# EAGLE board CPU68K20 - v1.1.2 (EAGLE 5.08), part 1 of 15
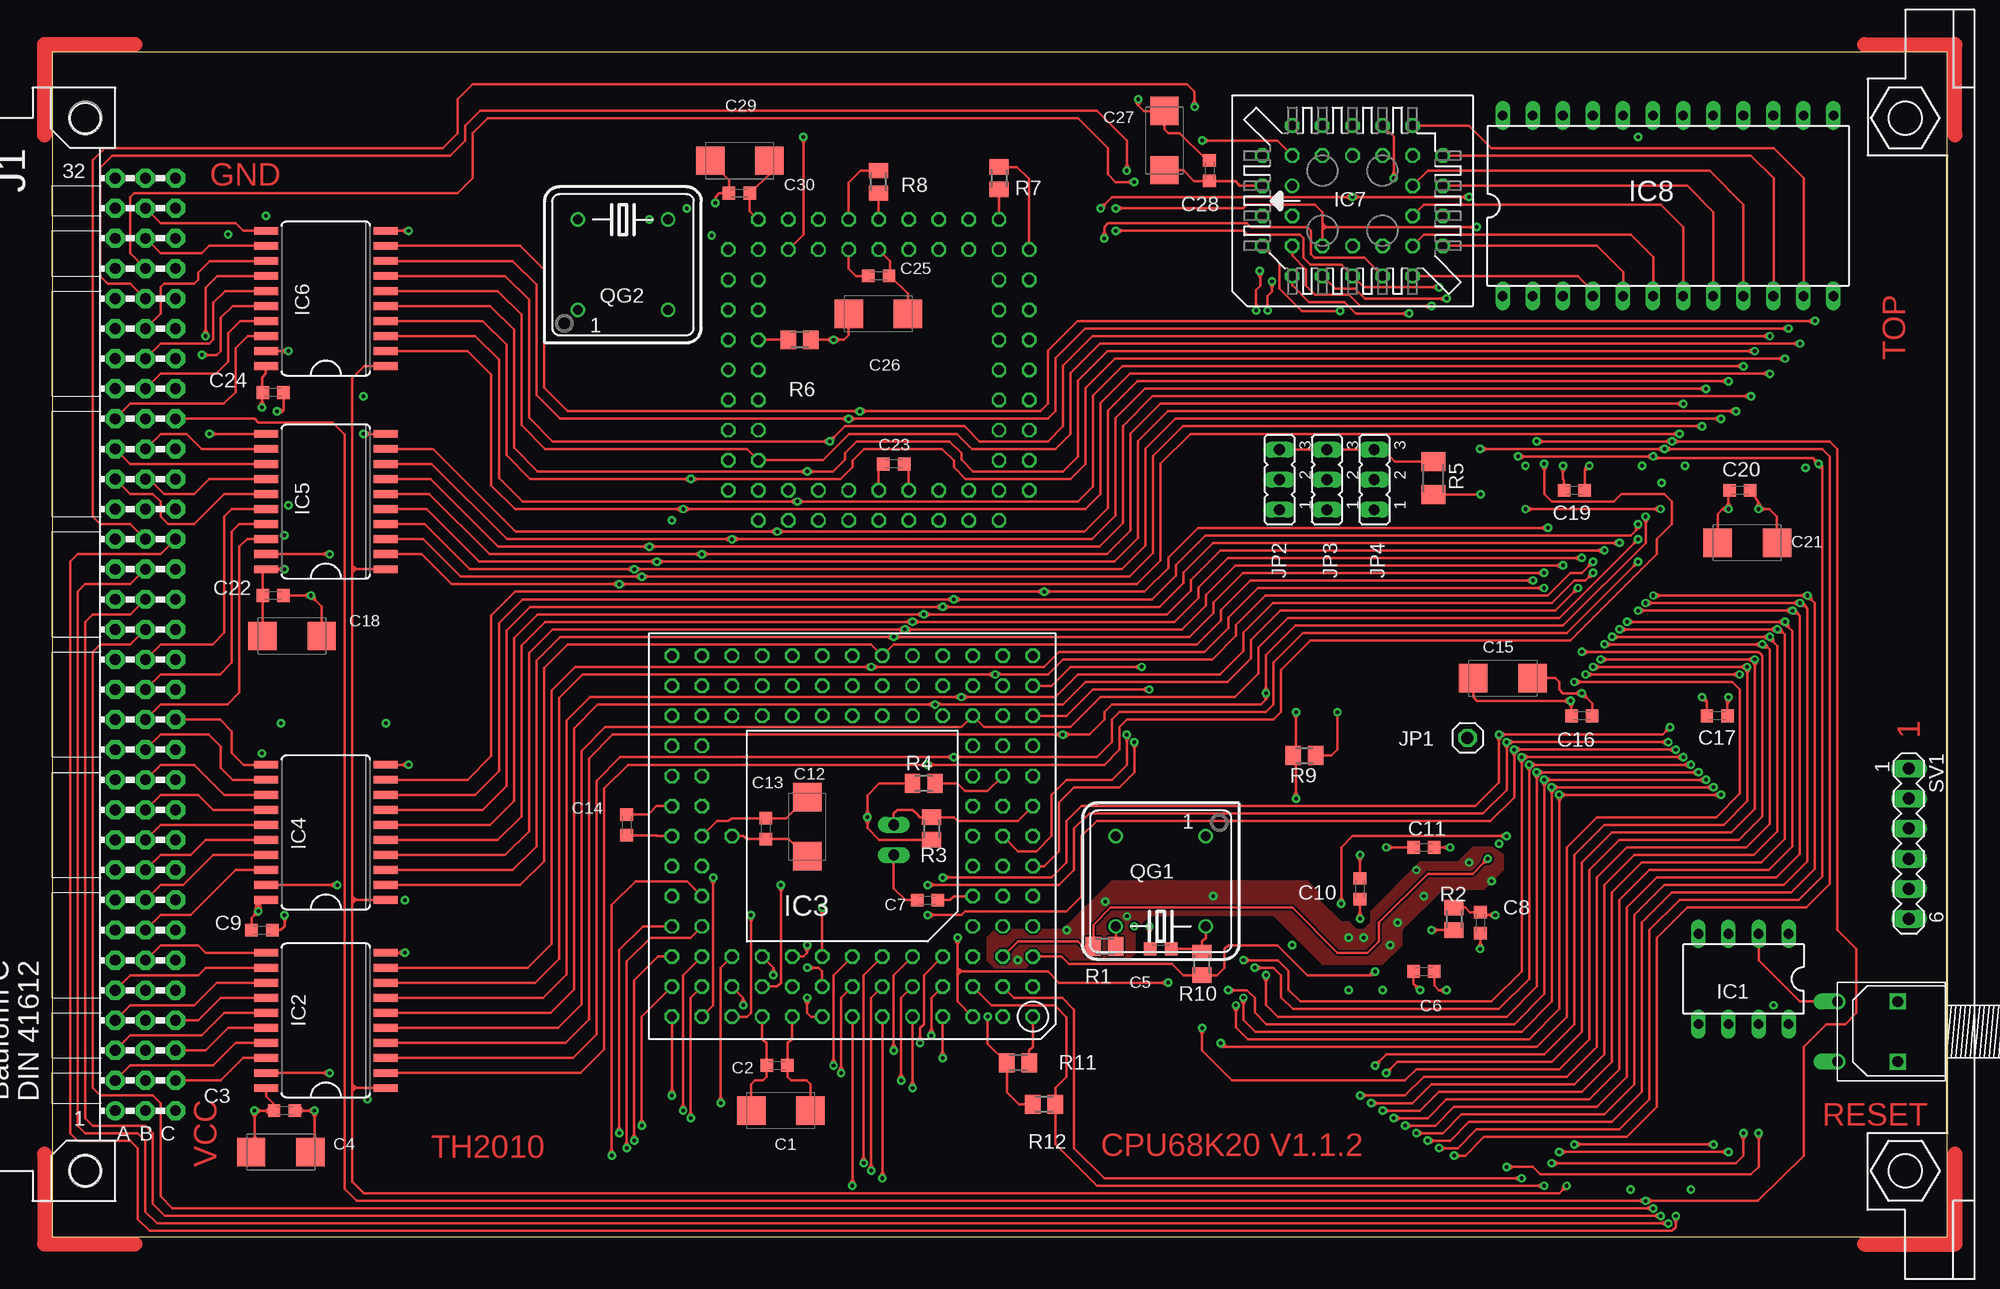
[diagram p2: board, top side]
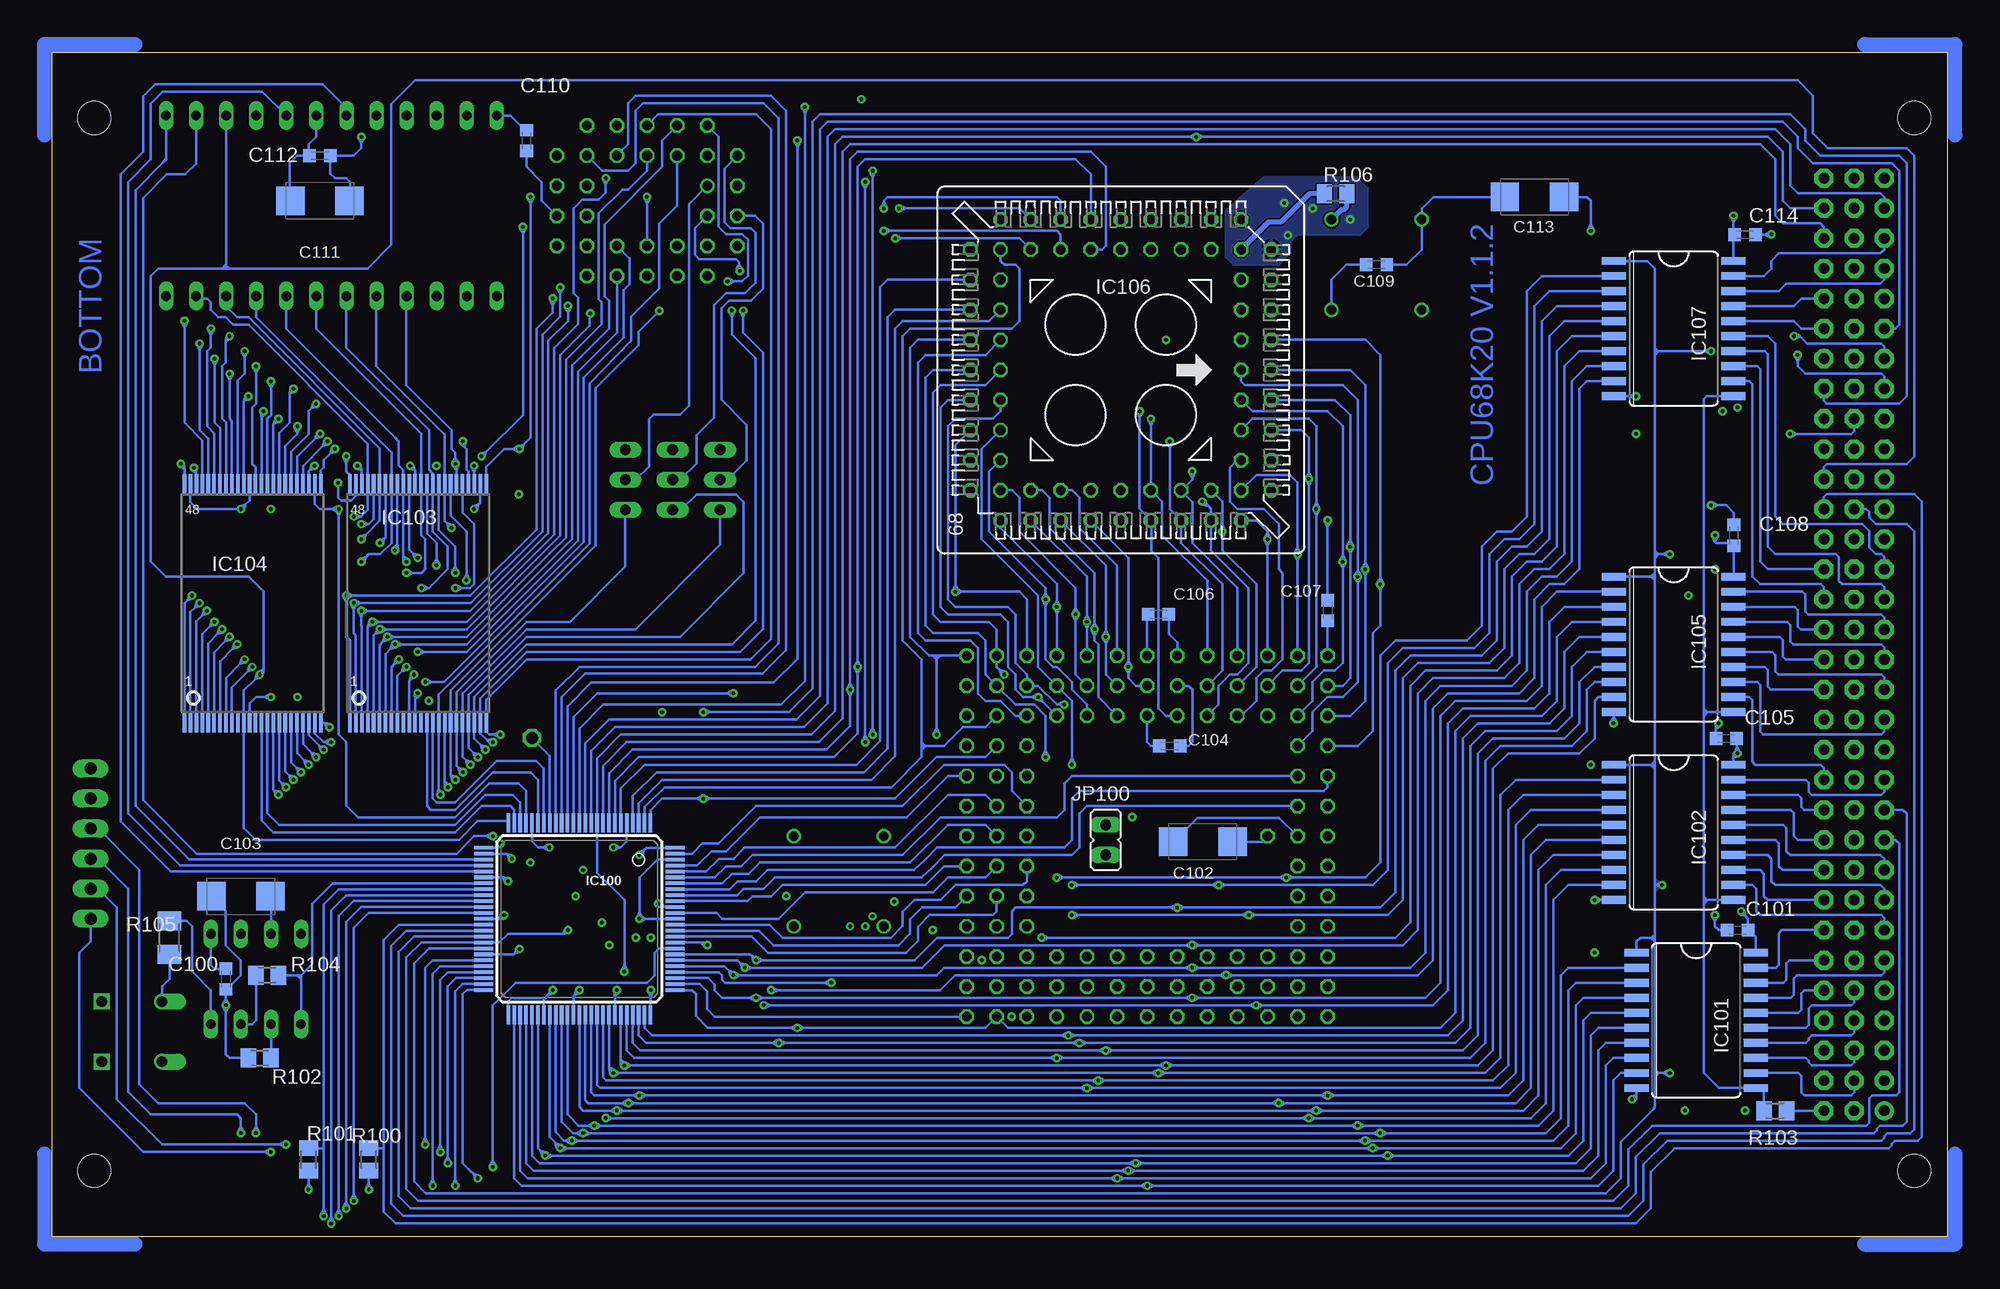
[diagram p3: board, bottom side, seen from below]

Size 160.02 x 100.03 mm. Coordinates in mm from the lower left corner, seen from the top.
Copper layers (1*2*3*16): Top 0.035mm / dielectric 0.36mm / $GND 0.018mm / dielectric 0.71mm / $VCC 0.035mm / dielectric 0.5mm / Bottom 0.035mm
Design rules "qp_designrules_6mil": minimum track width 6mil, minimum drill 0.3mm, track to track 6mil, track to pad 6mil, pad to pad 6mil, via to via 6mil, smd to smd 6mil, copper to edge 8mil, drill to drill 10mil, minimum pad ring 8mil, minimum via ring 8mil, stop-mask expansion 4mil, vias tented up to drill 16mil, thermal gap 10mil

## Footprints (pad centres in the part's own frame; a part is rotated, then mirrored left to right if it is on the bottom)
SMC_C = smd 2.4 x 2.4: + -2.5,0; - 2.5,0
C0603K = smd 1.05 x 1.08: 1 -0.875,0; 2 0.875,0
DIL08 = drill 0.813 long: 1 -3.81,-3.81; 2 -1.27,-3.81; 3 1.27,-3.81; 4 3.81,-3.81; 5 3.81,3.81; 6 1.27,3.81; 7 -1.27,3.81; 8 -3.81,3.81
SO20W = smd 0.66 x 2.032: 1 -5.715,-5.029; 2 -4.445,-5.029; 3 -3.175,-5.029; 4 -1.905,-5.029; 5 -0.635,-5.029; 6 0.635,-5.029; 7 1.905,-5.029; 8 3.175,-5.029; 9 4.445,-5.029; 10 5.715,-5.029; 11 5.715,5.029; 12 4.445,5.029; 13 3.175,5.029; 14 1.905,5.029; 15 0.635,5.029; 16 -0.635,5.029; 17 -1.905,5.029; 18 -3.175,5.029; 19 -4.445,5.029; 20 -5.715,5.029
MPGA114 = drill 0.813 octagon: A01 -15.24,15.24; A02 -12.7,15.24; A03 -10.16,15.24; A04 -7.62,15.24; A05 -5.08,15.24; A06 -2.54,15.24; A07 0,15.24; A08 2.54,15.24; A09 5.08,15.24; A10 7.62,15.24; A11 10.16,15.24; A12 12.7,15.24; A13 15.24,15.24; B01 -15.24,12.7; B02 -12.7,12.7; B03 -10.16,12.7; B04 -7.62,12.7; B05 -5.08,12.7; B06 -2.54,12.7; B07 0,12.7; B08 2.54,12.7; B09 5.08,12.7; B10 7.62,12.7; B11 10.16,12.7; B12 12.7,12.7; B13 15.24,12.7; C01 -15.24,10.16; C02 -12.7,10.16; C03 -10.16,10.16; C04 -7.62,10.16; C05 -5.08,10.16; C06 -2.54,10.16; C07 0,10.16; C08 2.54,10.16; C09 5.08,10.16; C10 7.62,10.16; C11 10.16,10.16; C12 12.7,10.16; C13 15.24,10.16; D01 -15.24,7.62; D02 -12.7,7.62; D03 -10.16,7.62; D12 12.7,7.62; D13 15.24,7.62; E01 -15.24,5.08; E02 -12.7,5.08; E03 -10.16,5.08; E12 12.7,5.08; E13 15.24,5.08; F01 -15.24,2.54; F02 -12.7,2.54; F03 -10.16,2.54; F12 12.7,2.54; F13 15.24,2.54; G01 -15.24,0; G02 -12.7,0; G03 -10.16,0; G11 10.16,0; G12 12.7,0; G13 15.24,0; H01 -15.24,-2.54; H02 -12.7,-2.54; H03 -10.16,-2.54; H12 12.7,-2.54; H13 15.24,-2.54; J01 -15.24,-5.08; J02 -12.7,-5.08; J03 -10.16,-5.08; J12 12.7,-5.08; J13 15.24,-5.08; K01 -15.24,-7.62; K02 -12.7,-7.62; K03 -10.16,-7.62; K12 12.7,-7.62; K13 15.24,-7.62; L01 -15.24,-10.16; L02 -12.7,-10.16; L03 -10.16,-10.16; L04 -7.62,-10.16; L05 -5.08,-10.16; L06 -2.54,-10.16; L07 0,-10.16; L08 2.54,-10.16; L09 5.08,-10.16; L10 7.62,-10.16; L11 10.16,-10.16; L12 12.7,-10.16; L13 15.24,-10.16; M01 -15.24,-12.7; M02 -12.7,-12.7; M03 -10.16,-12.7; M04 -7.62,-12.7; M05 -5.08,-12.7; M06 -2.54,-12.7; M07 0,-12.7; M08 2.54,-12.7; M09 5.08,-12.7; M10 7.62,-12.7; M11 10.16,-12.7; M12 12.7,-12.7; M13 15.24,-12.7; N01 -15.24,-15.24; N02 -12.7,-15.24; N03 -10.16,-15.24; N04 -7.62,-15.24; N05 -5.08,-15.24; N06 -2.54,-15.24; N07 0,-15.24; N08 2.54,-15.24; N09 5.08,-15.24; N10 7.62,-15.24; N11 10.16,-15.24; N12 12.7,-15.24; N13 15.24,-15.24
PLCC-S32 = drill 0.813 round: 1 1.27,5.08 | drill 0.813 octagon: 2 -1.27,7.62; 3 -1.27,5.08; 4 -3.81,7.62; 5 -6.35,5.08; 6 -3.81,5.08; 7 -6.35,2.54; 8 -3.81,2.54; 9 -6.35,0; 10 -3.81,0; 11 -6.35,-2.54; 12 -3.81,-2.54; 13 -6.35,-5.08; 14 -3.81,-7.62; 15 -3.81,-5.08; 16 -1.27,-7.62; 17 -1.27,-5.08; 18 1.27,-7.62; 19 1.27,-5.08; 20 3.81,-7.62; 21 6.35,-5.08; 22 3.81,-5.08; 23 6.35,-2.54; 24 3.81,-2.54; 25 6.35,0; 26 3.81,0; 27 6.35,2.54; 28 3.81,2.54; 29 6.35,5.08; 30 3.81,7.62; 31 3.81,5.08; 32 1.27,7.62
DIL24 = drill 0.813 long: 1 -13.97,-7.62; 2 -11.43,-7.62; 3 -8.89,-7.62; 4 -6.35,-7.62; 5 -3.81,-7.62; 6 -1.27,-7.62; 7 1.27,-7.62; 8 3.81,-7.62; 9 6.35,-7.62; 10 8.89,-7.62; 11 11.43,-7.62; 12 13.97,-7.62; 13 13.97,7.62; 14 11.43,7.62; 15 8.89,7.62; 16 6.35,7.62; 17 3.81,7.62; 18 1.27,7.62; 19 -1.27,7.62; 20 -3.81,7.62; 21 -6.35,7.62; 22 -8.89,7.62; 23 -11.43,7.62; 24 -13.97,7.62
VQ100 = smd 1.6 x 0.3: P1 -8.1,6; P2 -8.1,5.5; P3 -8.1,5; P4 -8.1,4.5; P5 -8.1,4; P6 -8.1,3.5; P7 -8.1,3; P8 -8.1,2.5; P9 -8.1,2; P10 -8.1,1.5; P11 -8.1,1; P12 -8.1,0.5; P13 -8.1,0; P14 -8.1,-0.5; P15 -8.1,-1; P16 -8.1,-1.5; P17 -8.1,-2; P18 -8.1,-2.5; P19 -8.1,-3; P20 -8.1,-3.5; P21 -8.1,-4; P22 -8.1,-4.5; P23 -8.1,-5; P24 -8.1,-5.5; P25 -8.1,-6; P51 8.1,-6; P52 8.1,-5.5; P53 8.1,-5; P54 8.1,-4.5; P55 8.1,-4; P56 8.1,-3.5; P57 8.1,-3; P58 8.1,-2.5; P59 8.1,-2; P60 8.1,-1.5; P61 8.1,-1; P62 8.1,-0.5; P63 8.1,0; P64 8.1,0.5; P65 8.1,1; P66 8.1,1.5; P67 8.1,2; P68 8.1,2.5; P69 8.1,3; P70 8.1,3.5; P71 8.1,4; P72 8.1,4.5; P73 8.1,5; P74 8.1,5.5; P75 8.1,6 | smd 0.3 x 1.6: P26 -6,-8.1; P27 -5.5,-8.1; P28 -5,-8.1; P29 -4.5,-8.1; P30 -4,-8.1; P31 -3.5,-8.1; P32 -3,-8.1; P33 -2.5,-8.1; P34 -2,-8.1; P35 -1.5,-8.1; P36 -1,-8.1; P37 -0.5,-8.1; P38 0,-8.1; P39 0.5,-8.1; P40 1,-8.1; P41 1.5,-8.1; P42 2,-8.1; P43 2.5,-8.1; P44 3,-8.1; P45 3.5,-8.1; P46 4,-8.1; P47 4.5,-8.1; P48 5,-8.1; P49 5.5,-8.1; P50 6,-8.1; P76 6,8.1; P77 5.5,8.1; P78 5,8.1; P79 4.5,8.1; P80 4,8.1; P81 3.5,8.1; P82 3,8.1; P83 2.5,8.1; P84 2,8.1; P85 1.5,8.1; P86 1,8.1; P87 0.5,8.1; P88 0,8.1; P89 -0.5,8.1; P90 -1,8.1; P91 -1.5,8.1; P92 -2,8.1; P93 -2.5,8.1; P94 -3,8.1; P95 -3.5,8.1; P96 -4,8.1; P97 -4.5,8.1; P98 -5,8.1; P99 -5.5,8.1; P100 -6,8.1
TSOP48W = smd 0.3 x 1.6: 1 0,-0.6; 2 0.5,-0.6; 3 1,-0.6; 4 1.5,-0.6; 5 2,-0.6; 6 2.5,-0.6; 7 3,-0.6; 8 3.5,-0.6; 9 4,-0.6; 10 4.5,-0.6; 11 5,-0.6; 12 5.5,-0.6; 13 6,-0.6; 14 6.5,-0.6; 15 7,-0.6; 16 7.5,-0.6; 17 8,-0.6; 18 8.5,-0.6; 19 9,-0.6; 20 9.5,-0.6; 21 10,-0.6; 22 10.5,-0.6; 23 11,-0.6; 24 11.5,-0.6; 25 11.5,19.6; 26 11,19.6; 27 10.5,19.6; 28 10,19.6; 29 9.5,19.6; 30 9,19.6; 31 8.5,19.6; 32 8,19.6; 33 7.5,19.6; 34 7,19.6; 35 6.5,19.6; 36 6,19.6; 37 5.5,19.6; 38 5,19.6; 39 4.5,19.6; 40 4,19.6; 41 3.5,19.6; 42 3,19.6; 43 2.5,19.6; 44 2,19.6; 45 1.5,19.6; 46 1,19.6; 47 0.5,19.6; 48 0,19.6
PLCC68-S = drill 0.813 round: 1 0,12.7 | drill 0.813 octagon: 2 0,10.16; 3 -2.54,12.7; 4 -2.54,10.16; 5 -5.08,12.7; 6 -5.08,10.16; 7 -7.62,12.7; 8 -7.62,10.16; 9 -10.16,12.7; 10 -12.7,10.16; 11 -10.16,10.16; 12 -12.7,7.62; 13 -10.16,7.62; 14 -12.7,5.08; 15 -10.16,5.08; 16 -12.7,2.54; 17 -10.16,2.54; 18 -12.7,0; 19 -10.16,0; 20 -12.7,-2.54; 21 -10.16,-2.54; 22 -12.7,-5.08; 23 -10.16,-5.08; 24 -12.7,-7.62; 25 -10.16,-7.62; 26 -12.7,-10.16; 27 -10.16,-12.7; 28 -10.16,-10.16; 29 -7.62,-12.7; 30 -7.62,-10.16; 31 -5.08,-12.7; 32 -5.08,-10.16; 33 -2.54,-12.7; 34 -2.54,-10.16; 35 0,-12.7; 36 0,-10.16; 37 2.54,-12.7; 38 2.54,-10.16; 39 5.08,-12.7; 40 5.08,-10.16; 41 7.62,-12.7; 42 7.62,-10.16; 43 10.16,-12.7; 44 12.7,-10.16; 45 10.16,-10.16; 46 12.7,-7.62; 47 10.16,-7.62; 48 12.7,-5.08; 49 10.16,-5.08; 50 12.7,-2.54; 51 10.16,-2.54; 52 12.7,0; 53 10.16,0; 54 12.7,2.54; 55 10.16,2.54; 56 12.7,5.08; 57 10.16,5.08; 58 12.7,7.62; 59 10.16,7.62; 60 12.7,10.16; 61 10.16,12.7; 62 10.16,10.16; 63 7.62,12.7; 64 7.62,10.16; 65 5.08,12.7; 66 5.08,10.16; 67 2.54,12.7; 68 2.54,10.16
VG96P = drill 0.914 pad 1.6 round: A1 154.94,39.37 | drill 0.914 pad 1.6 octagon: A2 154.94,36.83; A3 154.94,34.29; A4 154.94,31.75; A5 154.94,29.21; A6 154.94,26.67; A7 154.94,24.13; A8 154.94,21.59; A9 154.94,19.05; A10 154.94,16.51; A11 154.94,13.97; A12 154.94,11.43; A13 154.94,8.89; A14 154.94,6.35; A15 154.94,3.81; A16 154.94,1.27; A17 154.94,-1.27; A18 154.94,-3.81; A19 154.94,-6.35; A20 154.94,-8.89; A21 154.94,-11.43; A22 154.94,-13.97; A23 154.94,-16.51; A24 154.94,-19.05; A25 154.94,-21.59; A26 154.94,-24.13; A27 154.94,-26.67; A28 154.94,-29.21; A29 154.94,-31.75; A30 154.94,-34.29; A31 154.94,-36.83; A32 154.94,-39.37; B1 152.4,39.37; B2 152.4,36.83; B3 152.4,34.29; B4 152.4,31.75; B5 152.4,29.21; B6 152.4,26.67; B7 152.4,24.13; B8 152.4,21.59; B9 152.4,19.05; B10 152.4,16.51; B11 152.4,13.97; B12 152.4,11.43; B13 152.4,8.89; B14 152.4,6.35; B15 152.4,3.81; B16 152.4,1.27; B17 152.4,-1.27; B18 152.4,-3.81; B19 152.4,-6.35; B20 152.4,-8.89; B21 152.4,-11.43; B22 152.4,-13.97; B23 152.4,-16.51; B24 152.4,-19.05; B25 152.4,-21.59; B26 152.4,-24.13; B27 152.4,-26.67; B28 152.4,-29.21; B29 152.4,-31.75; B30 152.4,-34.29; B31 152.4,-36.83; B32 152.4,-39.37; C1 149.86,39.37; C2 149.86,36.83; C3 149.86,34.29; C4 149.86,31.75; C5 149.86,29.21; C6 149.86,26.67; C7 149.86,24.13; C8 149.86,21.59; C9 149.86,19.05; C10 149.86,16.51; C11 149.86,13.97; C12 149.86,11.43; C13 149.86,8.89; C14 149.86,6.35; C15 149.86,3.81; C16 149.86,1.27; C17 149.86,-1.27; C18 149.86,-3.81; C19 149.86,-6.35; C20 149.86,-8.89; C21 149.86,-11.43; C22 149.86,-13.97; C23 149.86,-16.51; C24 149.86,-19.05; C25 149.86,-21.59; C26 149.86,-24.13; C27 149.86,-26.67; C28 149.86,-29.21; C29 149.86,-31.75; C30 149.86,-34.29; C31 149.86,-36.83; C32 149.86,-39.37 | hole 2.794: 3.81,44.45; 3.81,-44.45; 157.48,44.45; 157.48,-44.45
1X01 = drill 1.016 octagon: 1 0,0
JP2 = drill 0.914 long: 1 -2.54,0; 2 0,0; 3 2.54,0
JP1 = drill 0.914 long: 1 0,-1.27; 2 0,1.27
DIL08S = drill 0.813 round: 1 -3.81,-3.81; 4 3.81,-3.81; 5 3.81,3.81; 8 -3.81,3.81
M0805 = smd 1.3 x 1.6: 1 -0.95,0; 2 0.95,0
M1206 = smd 1.6 x 2: 1 -1.4,0; 2 1.4,0
TS-21A = drill 0.9 offset: P1 0,0; P2 0,-5.08 | drill 0.9 square: P3 -5.08,0; P4 -5.08,-5.08
MA06-1 = drill 1.016 long: 1 -6.35,0; 2 -3.81,0; 3 -1.27,0; 4 1.27,0; 5 3.81,0; 6 6.35,0

## Placement (x,y rotation side)
C1  10µ/16  [SMC_C]  61.53,10.64 180 top
C2  100n  [C0603K]  61.21,14.45 180 top
C3  100n  [C0603K]  19.62,10.64 0 top
C4  10µ/16  [SMC_C]  19.3,7.15 0 top
C5  100n  [C0603K]  93.6,24.3 180 top
C6  100n  [C0603K]  115.82,22.39 180 top
C7  100n  [C0603K]  73.91,28.42 180 top
C8  100n  [C0603K]  120.59,26.52 270 top
C9  100n  [C0603K]  17.72,25.88 0 top
C10  100n  [C0603K]  110.43,29.38 90 top
C11  100n  [C0603K]  115.82,32.87 0 top
C12  10µ/16  [SMC_C]  63.75,34.62 90 top
C13  100n  [C0603K]  60.26,34.46 90 top
C14  100n  [C0603K]  48.51,34.77 90 top
C15  10µ/16  [SMC_C]  122.49,47.16 180 top
C16  100n  [C0603K]  129.16,43.98 180 top
C17  100n  [C0603K]  140.59,43.98 180 top
C18  10µ/16  [SMC_C]  20.25,50.72 0 top
C19  100n  [C0603K]  128.52,63.03 180 top
C20  100n  [C0603K]  142.49,63.03 180 top
C21  10µ/16  [SMC_C]  143.13,58.59 180 top
C22  100n  [C0603K]  18.67,54.14 0 top
C23  100n  [C0603K]  71.06,65.25 0 top
C24  100n  [C0603K]  18.67,71.29 0 top
C25  100n  [C0603K]  69.79,81.13 0 top
C26  10µ/16  [SMC_C]  69.75,77.92 0 top
C27  10µ/16  [SMC_C]  93.92,92.56 90 top
C28  100n  [C0603K]  97.73,90.02 90 top
C29  10µ/16  [SMC_C]  58.05,90.86 180 top
C30  100n  [C0603K]  58.02,88.12 180 top
C100  100n  [C0603K]  145.35,21.76 270 bottom
C101  100n  [C0603K]  17.72,25.88 180 bottom
C102  10µ/16  [SMC_C]  62.85,33.34 180 bottom
C103  10µ/16  [SMC_C]  144.08,28.74 180 bottom
C104  100n  [C0603K]  65.66,41.44 180 bottom
C105  100n  [C0603K]  18.67,42.08 180 bottom
C106  100n  [C0603K]  66.61,52.55 180 bottom
C107  100n  [C0603K]  52.32,52.87 90 bottom
C108  100n  [C0603K]  18.03,59.22 90 bottom
C109  100n  [C0603K]  48.2,82.08 180 bottom
C110  100n  [C0603K]  119.95,92.56 270 bottom
C111  10µ/16  [SMC_C]  137.41,87.48 0 bottom
C112  100n  [C0603K]  137.41,91.29 0 bottom
C113  10µ/16  [SMC_C]  34.86,87.8 0 bottom
C114  100n  [C0603K]  17.08,84.62 0 bottom
IC1  TLC7725D  [DIL08]  142.81,21.76 180 top
IC2  74HCT245DW  [SO20W]  23.11,18.26 90 top
IC3  [MPGA114]  67.56,33.82 180 top
IC4  74HCT245DW  [SO20W]  23.11,34.14 90 top
IC5  74HCT245DW  [SO20W]  23.11,62.08 90 top
IC6  74HCT245DW  [SO20W]  23.11,79.22 90 top
IC7  AM29F040JPLCC-S32  [PLCC-S32]  109.79,87.48 90 top
IC8  DS12C887DIL24  [DIL24]  136.44,87.05 0 top
IC100  XC95108VQ100VQ100  [VQ100]  115.51,26.84 270 bottom
IC101  74HCT573D  [SO20W]  21.21,18.26 270 bottom
IC102  74HCT573D  [SO20W]  23.11,34.14 270 bottom
IC103  CY62167ETSOP-W  [TSOP48W]  134.87,43.98 0 bottom
IC104  CY62167ETSOP-W  [TSOP48W]  148.84,43.98 0 bottom
IC105  74HCT573D  [SO20W]  23.11,50.01 270 bottom
IC106  [PLCC68-S]  69.79,73.19 270 bottom
IC107  74HCT573D  [SO20W]  23.11,76.68 270 bottom
J1  [VG96P]  160.27,50.01 180 top
JP1  [1X01]  119.51,42.12 0 top
JP2  [JP2]  103.63,63.92 90 top
JP3  [JP2]  107.63,63.92 90 top
JP4  [JP2]  111.63,63.92 90 top
JP100  CDIS  [JP1]  71.06,33.5 180 bottom
QG1  [DIL08S]  93.6,30.01 180 top
QG2  [DIL08S]  48.2,82.08 0 top
R1  10k  [M0805]  88.86,24.5 0 top
R2  10k  [M0805]  118.36,26.84 90 top
R3  10k  [M0805]  74.23,34.46 90 top
R4  10k  [M0805]  73.6,38.27 0 top
R5  10k  [M1206]  116.63,64.05 270 top
R6  10k  [M0805]  63.12,75.73 0 top
R7  10k  [M0805]  79.95,89.38 90 top
R8  10k  [M0805]  69.79,89.07 270 top
R9  10k  [M0805]  105.74,40.63 180 top
R10  10k  [M0805]  97.09,23.03 270 top
R11  10k  [M0805]  81.56,14.68 0 top
R12  10k  [M0805]  83.75,11.17 0 top
R100  10k  [M0805]  133.29,6.52 270 bottom
R101  10k  [M0805]  138.37,6.52 270 bottom
R102  10k  [M0805]  142.49,15.09 180 bottom
R103  10k  [M0805]  14.54,10.64 180 bottom
R104  10k  [M0805]  141.86,22.07 0 bottom
R105  10k  [M1206]  150.11,25.25 270 bottom
R106  10k  [M0805]  51.65,88.07 0 bottom
S1  [TS-21A]  150.75,14.77 180 top
SV1  [MA06-1]  156.78,33.19 270 top

## Tracks (layer width: path | path; a pad name or v marks a point on that pad's centre or on a via)
/AS  (via drill 0.3)
  Top 0.2: IC3.L01 85.66,43.98 87.88,46.2 92.14,46.2 | 92.14,46.2 92.2,46.2 | v92.65,46.2 92.2,46.2 | 92.14,46.2 | 92.14,46.2 92.2,46.17 | 92.52,45.98 | 92.14,46.2 92.2,46.24 | 92.14,46.2 92.2,46.17 | 92.14,46.2 92.2,46.24 | 92.52,46.42 | v92.65,46.2 92.52,46.42 | 92.2,46.2 92.5,45.99 v92.65,46.2 | 92.2,46.2 92.5,46.41 v92.65,46.2 | 92.52,45.98 92.2,46.17 | 92.52,45.98 | 92.2,46.17 92.49,46.4 | 92.2,46.24 92.49,46 | 92.49,46 | v92.65,46.2 92.49,46 | 92.52,46.42 92.2,46.24 | 92.52,45.98 92.2,46.17 | 92.52,45.98 | v92.65,46.2 92.52,45.98 | 92.2,46.17 92.49,46.4 | v92.65,46.2 92.49,46.4 | 92.2,46.24 92.49,46 | v92.65,46.2 92.49,46 | 92.52,46.42 92.2,46.24 | 92.14,46.2 | 92.14,46.2 92.52,45.98 | 92.52,45.98 | 92.52,45.98 | v92.65,46.2 92.52,45.98 | 92.14,46.2 92.52,46.42 | 92.52,46.42 | 92.52,46.42 v92.65,46.2 | 92.14,46.2 92.52,45.98 | 92.52,45.98 v92.65,46.2 | 92.14,46.2 92.52,46.42 | 92.52,46.42 | 92.52,46.42 v92.65,46.2 | 92.14,46.2 92.52,45.98 | v92.65,46.2 92.52,45.98 | 92.52,46.42 92.14,46.2 | 92.52,46.42 v92.65,46.2
  Bottom 0.2: v92.65,46.2 92.65,46.65 | 92.65,46.65 92.65,46.71 | IC106.21 71.37,83.35 71.06,83.67 71.06,90.33 72.33,91.61 92.01,91.61 92.65,90.97 92.65,46.71 | v92.65,46.2 92.65,45.75 | 92.65,45.75 92.65,45.69 | 92.65,45.69 92.65,43.12 94.65,41.12 111.01,41.12 113.01,39.12 IC100.P8 | 92.65,46.71 | 92.65,45.69 | 92.61,46.65 92.65,46.71 | 92.43,46.33 | v92.65,46.2 92.43,46.33 | 92.68,46.65 92.65,46.71 | 92.65,46.71 92.61,46.65 | 92.87,46.33 | 92.65,46.71 92.68,46.65 | 92.65,45.69 92.68,45.75 | 92.87,46.08 | 92.61,45.75 92.65,45.69 | 92.65,45.69 92.68,45.75 | 92.43,46.08 92.65,45.69 | 92.43,46.08 | v92.65,46.2 92.43,46.08 | 92.65,46.65 92.44,46.34 v92.65,46.2 | 92.65,46.65 92.86,46.34 v92.65,46.2 | 92.65,45.75 92.86,46.06 v92.65,46.2 | 92.65,45.75 92.44,46.06 v92.65,46.2 | 92.43,46.33 | 92.84,46.36 92.61,46.65 | v92.65,46.2 92.84,46.36 | 92.43,46.33 92.61,46.65 | 92.84,46.36 92.61,46.65 | v92.65,46.2 92.84,46.36 | 92.45,46.36 92.68,46.65 | 92.87,46.33 | 92.87,46.33 92.68,46.65 | v92.65,46.2 92.87,46.33 | 92.43,46.33 92.61,46.65 92.84,46.36 | v92.65,46.2 92.84,46.36 | 92.45,46.36 92.68,46.65 | v92.65,46.2 92.45,46.36 | 92.87,46.33 92.68,46.65 | 92.87,46.08 92.68,45.75 | 92.87,46.08 | 92.45,46.04 92.68,45.75 | 92.84,46.04 92.61,45.75 92.43,46.08 | 92.84,46.04 v92.65,46.2 | 92.87,46.08 | 92.87,46.08 92.68,45.75 | v92.65,46.2 92.87,46.08 | 92.45,46.04 92.68,45.75 | v92.65,46.2 92.45,46.04 | 92.84,46.04 92.61,45.75 | v92.65,46.2 92.84,46.04 | 92.43,46.08 92.61,45.75 | 92.43,46.33 92.65,46.71 | 92.65,45.69 | 92.43,46.33 92.65,46.71 | v92.65,46.2 92.43,46.33 | 92.65,46.71 | 92.87,46.33 | v92.65,46.2 92.87,46.33 | 92.43,46.33 92.65,46.71 | 92.43,46.33 | 92.65,46.71 | 92.87,46.33 92.65,46.71
  Bottom 0.2: v92.65,46.2 92.87,46.33 | 92.43,46.33 92.65,46.71 | v92.65,46.2 92.43,46.33 | 92.87,46.33 92.65,46.71 | v92.65,46.2 92.87,46.33 | 92.87,46.08 92.65,45.69 | 92.87,46.08 | 92.87,46.08 | v92.65,46.2 92.87,46.08 | 92.43,46.08 92.65,45.69 | 92.43,46.08 | v92.65,46.2 92.43,46.08 | 92.87,46.08 92.65,45.69 | v92.65,46.2 92.87,46.08 | 92.43,46.08 92.65,45.69 | 92.43,46.08 | v92.65,46.2 92.43,46.08 | 92.87,46.08 92.65,45.69 | v92.65,46.2 92.87,46.08 | 92.43,46.08 92.65,45.69 | v92.65,46.2 92.43,46.08
/AVEC
  Bottom 0.2: IC3.H02 81.22,37.31 84.39,37.31 88.84,32.87 101.54,32.87 102.49,31.91 103.71,31.91 104.79,30.84 IC100.P96
/BERR
  Top 0.2: R4.2 76.45,38.27 77.09,37.63 78.99,37.63 IC3.J02
/BG  (via drill 0.3)
  Top 0.2: IC3.B02 81.22,20.17 85.3,20.17 86.3,19.17 86.3,7.47 88.84,4.93 123.57,4.93 | 123.57,4.93 | 123.57,4.93 | 123.57,4.93 123.63,4.89 | 123.95,4.71 | 123.57,4.93 123.63,4.96 | 123.57,4.93 123.63,4.89 | 123.57,4.93 123.95,5.15 | 123.95,5.15 | v124.08,4.93 123.95,5.15 | 123.57,4.93 123.63,4.93 | v124.08,4.93 123.63,4.93 | 123.95,4.71 123.63,4.89 | 123.95,4.71 | 123.63,4.89 123.92,5.13 | 123.63,4.96 123.92,4.73 | 123.92,4.73 v124.08,4.93 | 123.95,5.15 123.63,4.96 | 123.95,4.71 123.63,4.89 | 123.95,4.71 | v124.08,4.93 123.95,4.71 | 123.63,4.89 123.92,5.13 | v124.08,4.93 123.92,5.13 | 123.63,4.96 123.92,4.73 | v124.08,4.93 123.92,4.73 | 123.95,5.15 123.63,4.96 | 123.63,4.93 123.94,4.72 v124.08,4.93 | 123.63,4.93 123.94,5.14 v124.08,4.93 | 123.57,4.93 123.95,4.71 | 123.95,4.71 | v124.08,4.93 123.95,4.71 | 123.57,4.93 123.95,5.15 | 123.95,5.15 | 123.95,5.15 v124.08,4.93 | 123.95,5.15 | 123.95,5.15 v124.08,4.93 | 123.95,4.71 123.57,4.93 | 123.95,4.71 | v124.08,4.93 123.95,4.71 | 123.95,5.15 123.57,4.93 | 123.57,4.93 123.95,4.71 | 123.95,4.71 v124.08,4.93 | 123.57,4.93 123.95,5.15 | 123.95,5.15 v124.08,4.93
  Bottom 0.2: IC100.P50 125,20.84 125.35,20.48 125.35,6.2 124.71,5.56 | v124.08,4.93 124.4,5.25 | 124.4,5.25 124.44,5.29 | 124.44,5.29 124.71,5.56 | 124.71,5.56 124.84,5.69 | 124.4,5.25 124.03,5.18 v124.08,4.93 | 124.4,5.25 124.33,4.88 v124.08,4.93 | 124.44,5.29 124.01,5.17 v124.08,4.93 | 124.44,5.29 124.32,4.86 v124.08,4.93
/BGACK
  Top 0.2: IC3.A01 82.8,16.04 82.49,15.72 82.49,14.7 R11.2
  Bottom 0.2: IC100.P77 105.35,21.34 104.71,20.7 104.71,19.22 104.08,18.58 IC3.A01
/BR  (via drill 0.3)
  Top 0.2: IC3.B03 79.31,19.53 84.66,19.53 85.66,18.53 85.66,13.5 84.71,12.55 R12.2 84.7,7.79 88.2,4.29 125.47,4.29 | 125.47,4.29 125.53,4.29 | v125.98,4.29 125.53,4.29 | 125.47,4.29 | 125.47,4.29 125.53,4.26 | 125.86,4.07 | 125.47,4.29 125.53,4.33 | 125.47,4.29 125.53,4.26 | 125.47,4.29 125.86,4.51 | 125.86,4.51 | v125.98,4.29 125.86,4.51 | 125.53,4.29 125.84,4.08 v125.98,4.29 | 125.53,4.29 125.84,4.5 v125.98,4.29 | 125.86,4.07 125.53,4.26 | 125.86,4.07 | 125.53,4.26 125.83,4.49 | 125.53,4.33 125.83,4.09 | 125.83,4.09 | v125.98,4.29 125.83,4.09 | 125.86,4.51 125.53,4.33 | 125.86,4.07 125.53,4.26 | 125.86,4.07 | v125.98,4.29 125.86,4.07 | 125.53,4.26 125.83,4.49 | v125.98,4.29 125.83,4.49 | 125.53,4.33 125.83,4.09 | v125.98,4.29 125.83,4.09 | 125.86,4.51 125.53,4.33 | 125.47,4.29 | 125.47,4.29 125.86,4.07 | 125.86,4.07 | 125.86,4.07 | v125.98,4.29 125.86,4.07 | 125.47,4.29 125.86,4.51 | 125.86,4.51 | 125.86,4.51 v125.98,4.29 | 125.47,4.29 125.86,4.07 | 125.86,4.07 v125.98,4.29 | 125.47,4.29 125.86,4.51 | 125.86,4.51 | 125.86,4.51 v125.98,4.29 | 125.47,4.29 125.86,4.07 | v125.98,4.29 125.86,4.07 | 125.86,4.51 125.47,4.29 | 125.86,4.51 v125.98,4.29
  Bottom 0.2: v125.98,4.29 125.98,4.74 | 125.98,4.74 125.98,4.8 | 125.98,4.8 125.98,20.7 125.35,21.34 IC100.P49 | 125.98,4.8 | 125.98,4.8 125.95,4.74 | 125.76,4.42 | 126.02,4.74 125.98,4.8 | 125.95,4.74 125.98,4.8 | 126.02,4.74 125.98,4.8 | 126.2,4.42 | v125.98,4.29 126.2,4.42 | 125.98,4.74 125.78,4.44 v125.98,4.29 | 125.98,4.74 126.19,4.44 v125.98,4.29 | 125.76,4.42 125.95,4.74 | 125.76,4.42 | 126.18,4.45 125.95,4.74 | 125.79,4.45 126.02,4.74 | 125.79,4.45 | v125.98,4.29 125.79,4.45 | 126.2,4.42 126.02,4.74 | 125.76,4.42 | 125.76,4.42 125.95,4.74 | v125.98,4.29 125.76,4.42 | 126.18,4.45 125.95,4.74 | v125.98,4.29 126.18,4.45 | 125.79,4.45 126.02,4.74 | v125.98,4.29 125.79,4.45 | 126.2,4.42 126.02,4.74 | 125.98,4.8 | 125.76,4.42 125.98,4.8 | 125.76,4.42 | 125.76,4.42 | v125.98,4.29 125.76,4.42 | 126.2,4.42 125.98,4.8 | 126.2,4.42 | v125.98,4.29 126.2,4.42 | 125.76,4.42 125.98,4.8 | v125.98,4.29 125.76,4.42 | 126.2,4.42 125.98,4.8 | 126.2,4.42 | v125.98,4.29 126.2,4.42 | 125.76,4.42 125.98,4.8 | v125.98,4.29 125.76,4.42 | 126.2,4.42 125.98,4.8 | v125.98,4.29 126.2,4.42
/BUSACK
  Bottom 0.2: J1.A31 5.33,87.8 5.65,88.11 12.64,88.11 13.27,88.75 13.27,92.24 14.54,93.51 93.92,93.51 94.55,92.88 94.55,45.03 96.55,43.03 112.51,43.03 114.51,41.03 IC100.P11
/BUSRQ
  Bottom 0.2: J1.A11 3.75,36.04 3.43,35.73 3.43,9.69 3.75,9.37 5.72,9.37 5.97,9.12 5.97,8.99 6.22,8.74 24.29,8.74 26.29,6.74 26.29,3.66 27.56,2.39 129.75,2.39 130.75,3.39 130.75,24.06 129.48,25.34 IC100.P41
/CDIS
  Top 0.2: IC3.H01 81.53,35.09 76.45,35.09 76.14,35.41 R3.2 73.28,35.41 72.96,35.72 72.96,35.73 72.64,36.04 71.37,36.04 71.06,35.73 JP100.1
/CS1
  Bottom 0.2: IC100.P17 117.51,46.11 115.51,48.11 100.68,48.11 98.68,50.11 98.68,94.46 99.95,95.73 110.11,95.73 110.74,95.1 110.74,90.65 111.38,90.02 113.6,90.02 IC7.22
/CS2  (via drill 0.3)
  Top 0.2: v135.83,61.44 135.38,61.44 | 135.38,61.44 135.32,61.44 | 124.91,61.44 124.85,61.44 | v124.4,61.44 124.85,61.44 | 135.32,61.44 124.91,61.44 | 124.91,61.44 | 124.91,61.44 124.84,61.48 | 124.52,61.66 | v124.4,61.44 124.52,61.66 | 124.91,61.44 124.84,61.41 | 124.91,61.44 124.84,61.48 | 124.91,61.44 124.84,61.41 | 124.52,61.22 | 135.32,61.44 | 135.32,61.44 135.38,61.41 | 135.7,61.22 | 135.38,61.48 135.32,61.44 | 135.32,61.44 135.38,61.41 | 135.7,61.66 135.32,61.44 | 135.7,61.66 | v135.83,61.44 135.7,61.66 | 124.85,61.44 124.54,61.65 v124.4,61.44 | 124.85,61.44 124.54,61.23 v124.4,61.44 | 124.52,61.66 | 124.84,61.48 124.56,61.24 | v124.4,61.44 124.56,61.24 | 124.52,61.66 124.84,61.48 | 124.84,61.48 124.56,61.24 | v124.4,61.44 124.56,61.24 | 124.84,61.41 124.56,61.64 | 124.84,61.41 124.52,61.22 | 124.52,61.22 | v124.4,61.44 124.52,61.22 | 124.52,61.66 124.84,61.48 | 124.84,61.48 124.56,61.24 | v124.4,61.44 124.56,61.24 | 124.56,61.64 124.84,61.41 | v124.4,61.44 124.56,61.64 | 124.52,61.22 124.84,61.41 | 135.38,61.44 135.68,61.23 v135.83,61.44 | 135.38,61.44 135.68,61.65 v135.83,61.44 | 135.7,61.22 135.38,61.41 | 135.7,61.22 | 135.67,61.64 135.38,61.41 | 135.67,61.24 135.38,61.48 | 135.67,61.24 | v135.83,61.44 135.67,61.24 | 135.7,61.66 135.38,61.48 | 135.7,61.22 | 135.7,61.22 135.38,61.41 | v135.83,61.44 135.7,61.22 | 135.67,61.64 135.38,61.41 | v135.83,61.44 135.67,61.64 | 135.67,61.24 135.38,61.48 | v135.83,61.44 135.67,61.24 | 135.7,61.66 135.38,61.48 | 124.91,61.44 124.52,61.66 | 124.52,61.66 124.91,61.44 | 124.52,61.66 v124.4,61.44 | 124.91,61.44 | 124.52,61.22 | v124.4,61.44 124.52,61.22 | 124.91,61.44 124.52,61.66 | 124.52,61.66 | 124.91,61.44 | 124.91,61.44 124.52,61.22
  Top 0.2: 124.52,61.22 v124.4,61.44 | 124.91,61.44 124.52,61.66 | 124.52,61.66 v124.4,61.44 | 124.91,61.44 124.52,61.22 | 124.52,61.22 v124.4,61.44 | 135.32,61.44 | 135.7,61.22 135.32,61.44 | 135.7,61.22 | 135.7,61.22 | v135.83,61.44 135.7,61.22 | 135.7,61.66 135.32,61.44 | 135.7,61.66 | v135.83,61.44 135.7,61.66 | 135.7,61.22 135.32,61.44 | v135.83,61.44 135.7,61.22 | 135.7,61.66 135.32,61.44 | 135.7,61.66 | v135.83,61.44 135.7,61.66 | 135.7,61.22 135.32,61.44 | v135.83,61.44 135.7,61.22 | 135.7,61.66 135.32,61.44 | v135.83,61.44 135.7,61.66
  Bottom 0.2: v135.83,61.44 136.28,61.44 | 136.28,61.44 136.34,61.44 | IC104.26 137.84,61.87 137.41,61.44 136.34,61.44 | IC103.26 123.87,61.97 124.04,61.8 | v124.4,61.44 124.08,61.76 | 124.08,61.76 124.04,61.8 | 124.04,61.8 | IC100.P22 120.01,37.63 120.64,38.27 123.13,38.27 125.98,35.41 134.19,35.41 135.19,36.41 135.19,41.76 135.83,42.39 135.83,60.93 | 135.83,60.93 135.83,60.99 | v135.83,61.44 135.83,60.99 | 124.04,61.8 | 124.46,61.69 124.04,61.8 | 124.15,61.38 124.04,61.8 | 124.04,61.8 | 124.04,61.8 124.05,61.73 | 124.1,61.78 124.04,61.8 | 124.1,61.78 | 136.34,61.44 | 135.83,60.93 136.05,61.32 | 135.83,60.93 | 136.28,61.48 136.34,61.44 | 135.95,61.66 | v135.83,61.44 135.95,61.66 | 136.28,61.41 136.34,61.44 | 136.34,61.44 136.28,61.48 | 135.95,61.22 | 136.34,61.44 136.28,61.41 | 135.83,60.93 135.86,60.99 | 136.05,61.32 | v135.83,61.44 136.05,61.32 | 135.83,60.93 135.79,60.99 | 135.83,60.93 135.86,60.99 | 135.83,60.93 135.79,60.99 | 135.61,61.32 | 124.08,61.76 124.15,61.4 v124.4,61.44 | 124.08,61.76 124.44,61.69 v124.4,61.44 | 124.15,61.41 124.1,61.78 | v124.4,61.44 124.15,61.41 | 124.46,61.69 124.1,61.78 | 124.15,61.38 124.05,61.73 | 124.15,61.38 | 124.42,61.69 124.05,61.73 | 124.15,61.38 124.05,61.73 | 124.42,61.69 124.05,61.73 | v124.4,61.44 124.42,61.69 | 124.15,61.41 124.1,61.78 | v124.4,61.44 124.15,61.41 | 124.46,61.69 124.1,61.78 | 136.28,61.44 135.97,61.65 v135.83,61.44 | 136.28,61.44 135.97,61.23 v135.83,61.44 | 135.83,60.99 136.04,61.3 v135.83,61.44 | 135.83,60.99 135.62,61.3 v135.83,61.44 | 135.95,61.66 | 135.99,61.24 136.28,61.48 | v135.83,61.44 135.99,61.24 | 135.95,61.66 136.28,61.48 | 135.99,61.24 136.28,61.48 | v135.83,61.44 135.99,61.24 | 135.99,61.64 136.28,61.41
  Bottom 0.2: 135.95,61.22 | 135.95,61.22 136.28,61.41 | v135.83,61.44 135.95,61.22 | 135.95,61.66 136.28,61.48 | 135.99,61.24 136.28,61.48 | v135.83,61.44 135.99,61.24 | 135.99,61.64 136.28,61.41 | v135.83,61.44 135.99,61.64 | 135.95,61.22 136.28,61.41 | 136.05,61.32 135.86,60.99 | 136.05,61.32 | 135.86,60.99 135.63,61.28 | v135.83,61.44 135.63,61.28 | 135.79,60.99 136.02,61.28 | 135.79,60.99 135.61,61.32 | 135.61,61.32 | v135.83,61.44 135.61,61.32 | 136.05,61.32 135.86,60.99 135.63,61.28 | v135.83,61.44 135.63,61.28 | 136.02,61.28 135.79,60.99 | v135.83,61.44 136.02,61.28 | 135.61,61.32 135.79,60.99 | v124.4,61.44 124.18,61.57 | 124.15,61.38 124.04,61.8 | v124.4,61.44 124.15,61.38 | 124.46,61.69 124.04,61.8 | 124.46,61.69 | v124.4,61.44 124.46,61.69 | 124.15,61.38 124.04,61.8 | v124.4,61.44 124.15,61.38 | 124.46,61.69 124.04,61.8 | v124.4,61.44 124.46,61.69 | 135.95,61.66 136.34,61.44 | 135.83,60.93 136.05,61.32 | 135.95,61.66 136.34,61.44 | v135.83,61.44 135.95,61.66 | 136.34,61.44 | 135.95,61.22 | v135.83,61.44 135.95,61.22 | 135.95,61.66 136.34,61.44 | 135.95,61.66 | 136.34,61.44 | 135.95,61.22 136.34,61.44 | v135.83,61.44 135.95,61.22 | 135.95,61.66 136.34,61.44 | v135.83,61.44 135.95,61.66 | 135.95,61.22 136.34,61.44 | v135.83,61.44 135.95,61.22 | 136.05,61.32 135.83,60.93 | 136.05,61.32 v135.83,61.44 | 135.83,60.93 | 135.61,61.32 | v135.83,61.44 135.61,61.32 | 135.83,60.93 136.05,61.32 | 136.05,61.32 | 135.83,60.93 | 135.83,60.93 135.61,61.32 | 135.61,61.32 v135.83,61.44 | 135.83,60.93 136.05,61.32 | 136.05,61.32 v135.83,61.44 | 135.83,60.93 135.61,61.32 | 135.61,61.32 v135.83,61.44
/DS  (via drill 0.3)
  Top 0.2: IC3.M01 84.39,46.52 85.98,48.11 91.5,48.11 | 91.5,48.11 91.56,48.11 | v92.01,48.11 91.56,48.11 | 91.5,48.11 | 91.5,48.11 91.56,48.07 | 91.89,47.89 | 91.5,48.11 91.56,48.14 | 91.5,48.11 91.56,48.07 | 91.5,48.11 91.56,48.14 | 91.89,48.33 | v92.01,48.11 91.89,48.33 | 91.56,48.11 91.87,47.9 v92.01,48.11 | 91.56,48.11 91.87,48.32 v92.01,48.11 | 91.89,47.89 91.56,48.07 | 91.89,47.89 | 91.56,48.07 91.85,48.31 | 91.56,48.14 91.85,47.91 | 91.85,47.91 | v92.01,48.11 91.85,47.91 | 91.89,48.33 91.56,48.14 | 91.89,47.89 91.56,48.07 | 91.89,47.89 | v92.01,48.11 91.89,47.89 | 91.56,48.07 91.85,48.31 | v92.01,48.11 91.85,48.31 | 91.56,48.14 91.85,47.91 | v92.01,48.11 91.85,47.91 | 91.89,48.33 91.56,48.14 | 91.5,48.11 | 91.5,48.11 91.89,47.89 | 91.89,47.89 | 91.89,47.89 | v92.01,48.11 91.89,47.89 | 91.5,48.11 91.89,48.33 | 91.89,48.33 | 91.89,48.33 v92.01,48.11 | 91.5,48.11 91.89,47.89 | 91.89,47.89 v92.01,48.11 | 91.5,48.11 91.89,48.33 | 91.89,48.33 | 91.89,48.33 v92.01,48.11 | 91.5,48.11 91.89,47.89 | v92.01,48.11 91.89,47.89 | 91.89,48.33 91.5,48.11 | 91.89,48.33 v92.01,48.11
  Bottom 0.2: v92.01,48.11 92.01,48.56 | 92.01,48.56 92.01,48.62 | IC106.20 72.33,89.7 73.6,90.97 91.38,90.97 92.01,90.33 92.01,48.62 | v92.01,48.11 92.01,47.66 | 92.01,47.66 92.01,47.6 | 92.01,47.6 92.01,42.49 94.01,40.49 110.51,40.49 112.51,38.49 IC100.P7 | 92.01,48.62 | 92.01,47.6 | 91.98,48.56 92.01,48.62 | 91.79,48.23 | v92.01,48.11 91.79,48.23 | 92.05,48.56 92.01,48.62 | 92.01,48.62 91.98,48.56 | 92.23,48.23 | 92.01,48.62 92.05,48.56 | 92.01,47.6 92.05,47.66 | 92.23,47.98 | 91.98,47.66 92.01,47.6 | 92.01,47.6 92.05,47.66 | 91.79,47.98 92.01,47.6 | 91.79,47.98 | v92.01,48.11 91.79,47.98 | 92.01,48.56 91.8,48.25 v92.01,48.11 | 92.01,48.56 92.22,48.25 v92.01,48.11 | 92.01,47.66 92.22,47.96 v92.01,48.11 | 92.01,47.66 91.8,47.96 v92.01,48.11 | 91.79,48.23 | 92.21,48.27 91.98,48.56 | v92.01,48.11 92.21,48.27 | 91.79,48.23 91.98,48.56 | 92.21,48.27 91.98,48.56 | v92.01,48.11 92.21,48.27 | 91.81,48.27 92.05,48.56 | 92.23,48.23 | 92.23,48.23 92.05,48.56 | v92.01,48.11 92.23,48.23 | 91.79,48.23 91.98,48.56 | 92.21,48.27 91.98,48.56 | v92.01,48.11 92.21,48.27 | 91.81,48.27 92.05,48.56 | v92.01,48.11 91.81,48.27 | 92.23,48.23 92.05,48.56 | 92.23,47.98 92.05,47.66 | 92.23,47.98 | 91.81,47.95 92.05,47.66 | 92.21,47.95 91.98,47.66 | 92.21,47.95 v92.01,48.11 | 91.79,47.98 91.98,47.66 | 92.23,47.98 | 92.23,47.98 92.05,47.66 | v92.01,48.11 92.23,47.98 | 91.81,47.95 92.05,47.66 | v92.01,48.11 91.81,47.95 | 92.21,47.95 91.98,47.66 | v92.01,48.11 92.21,47.95 | 91.79,47.98 91.98,47.66 | 91.79,48.23 92.01,48.62 | 92.01,47.6 | 91.79,48.23 92.01,48.62 | v92.01,48.11 91.79,48.23 | 92.01,48.62 | 92.23,48.23 | v92.01,48.11 92.23,48.23 | 91.79,48.23 92.01,48.62 | 91.79,48.23 | 92.01,48.62 | 92.23,48.23 92.01,48.62
  Bottom 0.2: v92.01,48.11 92.23,48.23 | 91.79,48.23 92.01,48.62 | v92.01,48.11 91.79,48.23 | 92.23,48.23 92.01,48.62 | v92.01,48.11 92.23,48.23 | 92.23,47.98 92.01,47.6 | 92.23,47.98 | 92.23,47.98 | v92.01,48.11 92.23,47.98 | 91.79,47.98 92.01,47.6 | 91.79,47.98 | v92.01,48.11 91.79,47.98 | 92.23,47.98 92.01,47.6 | v92.01,48.11 92.23,47.98 | 91.79,47.98 92.01,47.6 | 91.79,47.98 | v92.01,48.11 91.79,47.98 | 92.23,47.98 92.01,47.6 | v92.01,48.11 92.23,47.98 | 91.79,47.98 92.01,47.6 | v92.01,48.11 91.79,47.98
/DSACK0
  Bottom 0.2: IC3.H03 78.99,37.63 78.99,39.22 79.63,39.85 84.71,39.85 88.2,36.36 100.58,36.36 103.76,33.19 105.13,33.19 105.98,32.34 IC100.P99
/DSACK1
  Bottom 0.2: IC3.J01 84.39,38.9 87.88,35.41 100.27,35.41 103.12,32.55 104.35,32.55 105.35,31.55 105.56,31.34 IC100.P97
/FDSACK0
  Bottom 0.2: IC106.31 88.84,78.27 89.47,77.64 89.47,41.22 91.47,39.22 109.01,39.22 111.01,37.22 IC100.P4
/FDSACK1
  Bottom 0.2: IC106.32 80.9,77.32 88.2,77.32 88.84,76.68 88.84,40.58 90.84,38.58 108.51,38.58 110.51,36.58 IC100.P3
/FOE
  Bottom 0.2: IC100.P16 117.01,45.56 115.01,47.56 100.04,47.56 98.04,49.56 98.04,95.1 99.31,96.37 110.74,96.37 111.38,95.73 111.38,92.24 IC7.24
/FPU_CS
  Bottom 0.2: IC106.29 89.47,80.81 90.11,80.17 90.11,41.85 92.11,39.85 110.01,39.85 112.01,37.85 IC100.P6
/FWE  (via drill 0.3)
  Top 0.2: v97.09,92.56 97.54,92.56 | 97.54,92.56 97.6,92.56 | IC7.31 103.44,92.56 97.6,92.56 | 97.6,92.56 | 97.54,92.59 97.6,92.56 | 97.22,92.78 | v97.09,92.56 97.22,92.78 | 97.54,92.52 97.6,92.56 | 97.6,92.56 97.54,92.59 | 97.22,92.34 | 97.6,92.56 97.54,92.52 | 97.54,92.56 97.23,92.77 v97.09,92.56 | 97.54,92.56 97.23,92.35 v97.09,92.56 | 97.22,92.78 | 97.25,92.36 97.54,92.59 | v97.09,92.56 97.25,92.36 | 97.22,92.78 97.54,92.59 | 97.25,92.36 97.54,92.59 | v97.09,92.56 97.25,92.36 | 97.25,92.75 97.54,92.52 | 97.22,92.34 | 97.22,92.34 97.54,92.52 | v97.09,92.56 97.22,92.34 | 97.22,92.78 97.54,92.59 | 97.25,92.36 97.54,92.59 | v97.09,92.56 97.25,92.36 | 97.25,92.75 97.54,92.52 | v97.09,92.56 97.25,92.75 | 97.22,92.34 97.54,92.52 | 97.22,92.78 97.6,92.56 | 97.22,92.78 97.6,92.56 | v97.09,92.56 97.22,92.78 | 97.6,92.56 | 97.22,92.34 | v97.09,92.56 97.22,92.34 | 97.22,92.78 97.6,92.56 | 97.22,92.78 | 97.6,92.56 | 97.22,92.34 97.6,92.56 | v97.09,92.56 97.22,92.34 | 97.22,92.78 97.6,92.56 | v97.09,92.56 97.22,92.78 | 97.22,92.34 97.6,92.56 | v97.09,92.56 97.22,92.34
  Bottom 0.2: 97.09,92.05 97.09,92.11 | v97.09,92.56 97.09,92.11 | IC100.P15 116.51,44.79 114.51,46.79 99.09,46.79 97.09,48.79 97.09,92.05 | 97.09,92.05 97.31,92.43 | 97.09,92.05 | 97.09,92.05 97.13,92.11 | 97.31,92.43 | v97.09,92.56 97.31,92.43 | 97.09,92.05 97.06,92.11 | 97.09,92.05 97.13,92.11 | 97.09,92.05 97.06,92.11 | 96.87,92.43 | 97.09,92.11 97.3,92.41 v97.09,92.56 | 97.09,92.11 96.88,92.41 v97.09,92.56 | 97.31,92.43 97.13,92.11 | 97.31,92.43 | 97.13,92.11 96.89,92.4 | v97.09,92.56 96.89,92.4 | 97.06,92.11 97.29,92.4 | 97.06,92.11 96.87,92.43 | 96.87,92.43 | v97.09,92.56 96.87,92.43 | 97.31,92.43 97.13,92.11 96.89,92.4 | v97.09,92.56 96.89,92.4 | 97.29,92.4 97.06,92.11 | v97.09,92.56 97.29,92.4 | 96.87,92.43 97.06,92.11 | 97.09,92.05 97.31,92.43 | 97.31,92.43 97.09,92.05 | 97.31,92.43 v97.09,92.56 | 97.09,92.05 | 96.87,92.43 | v97.09,92.56 96.87,92.43 | 97.09,92.05 97.31,92.43 | 97.31,92.43 | 97.09,92.05 | 97.09,92.05 96.87,92.43 | 96.87,92.43 v97.09,92.56 | 97.09,92.05 97.31,92.43 | 97.31,92.43 v97.09,92.56 | 97.09,92.05 96.87,92.43 | 96.87,92.43 v97.09,92.56
/HALT  (via drill 0.3)
  Top 0.2: v105.03,44.3 105.03,43.85 | 105.03,43.85 105.03,43.79 | 105.03,37.51 105.03,37.45 | v105.03,36.99 105.03,37.45 | 105.25,44.17 105.03,43.79 | 105.03,43.79 | 105.03,40.81 105.03,37.51 | 105.03,43.79 105.03,40.81 | 105.03,43.79 105.06,43.85 | 105.25,44.17 | v105.03,44.3 105.25,44.17 | 104.99,43.85 105.03,43.79 | 105.03,43.79 105.06,43.85 | 104.81,44.17 | 105.03,43.79 104.99,43.85 | 105.03,37.51 | 105.03,37.51 104.99,37.44 | 104.81,37.12 | 105.03,37.51 105.06,37.44 | 105.03,37.51 104.99,37.44 | 105.03,37.51 105.06,37.44 | 105.25,37.12 | v105.03,36.99 105.25,37.12 | 105.03,43.85 105.24,44.15 v105.03,44.3 | 105.03,43.85 104.82,44.15 v105.03,44.3 | 105.25,44.17 105.06,43.85 | 105.25,44.17 | 104.83,44.14 105.06,43.85 | v105.03,44.3 104.83,44.14 | 105.23,44.14 104.99,43.85 | 104.81,44.17 | 104.81,44.17 104.99,43.85 | v105.03,44.3 104.81,44.17 | 105.25,44.17 105.06,43.85 | 104.83,44.14 105.06,43.85 | v105.03,44.3 104.83,44.14 | 105.23,44.14 104.99,43.85 | v105.03,44.3 105.23,44.14 | 104.81,44.17 104.99,43.85 | 105.03,37.45 104.82,37.14 v105.03,36.99 | 105.03,37.45 105.24,37.14 v105.03,36.99 | 104.81,37.12 104.99,37.44 | 104.81,37.12 | 104.99,37.44 105.23,37.15 | 105.06,37.44 104.83,37.15 | 104.83,37.15 | v105.03,36.99 104.83,37.15 | 105.25,37.12 105.06,37.44 | 104.81,37.12 104.99,37.44 | 104.81,37.12 | v105.03,36.99 104.81,37.12 | 104.99,37.44 105.23,37.15 | v105.03,36.99 105.23,37.15 | 105.06,37.44 104.83,37.15 | v105.03,36.99 104.83,37.15 | 105.25,37.12 105.06,37.44 | 105.25,44.17 105.03,43.79 | 105.25,44.17 105.03,43.79 | v105.03,44.3 105.25,44.17 | 105.03,43.79 | 104.81,44.17 | v105.03,44.3 104.81,44.17 | 105.25,44.17 105.03,43.79 | 105.25,44.17 | 105.03,43.79 | 104.81,44.17 105.03,43.79
  Top 0.2: v105.03,44.3 104.81,44.17 | 105.25,44.17 105.03,43.79 | v105.03,44.3 105.25,44.17 | 104.81,44.17 105.03,43.79 | v105.03,44.3 104.81,44.17 | 105.03,37.51 | 105.03,37.51 104.81,37.12 | 104.81,37.12 | 104.81,37.12 | v105.03,36.99 104.81,37.12 | 105.03,37.51 105.25,37.12 | 105.25,37.12 | 105.25,37.12 v105.03,36.99 | 105.03,37.51 104.81,37.12 | 104.81,37.12 v105.03,36.99 | 105.03,37.51 105.25,37.12 | 105.25,37.12 | 105.25,37.12 v105.03,36.99 | 105.03,37.51 104.81,37.12 | v105.03,36.99 104.81,37.12 | 105.25,37.12 105.03,37.51 | 105.25,37.12 v105.03,36.99 | R9.2 104.95,40.73 105.03,40.81
  Bottom 0.2: J1.C25 10.41,70.59 10.16,70.33 4.06,70.33 3.43,70.97 3.43,90.65 4.06,91.29 10.73,91.29 12,92.56 12,93.51 13.27,94.78 95.19,94.78 95.82,94.14 95.82,46.3 97.82,44.3 104.52,44.3 | IC3.K02 81.22,40.49 85.34,40.49 88.84,36.99 104.52,36.99 | v105.03,36.99 105.48,36.99 | 105.48,36.99 105.54,36.99 | IC100.P1 109.51,36.01 108.52,36.99 105.54,36.99 | 104.52,44.3 104.58,44.3 | v105.03,44.3 104.58,44.3 | v105.03,36.99 104.58,36.99 | 104.58,36.99 104.52,36.99 | 104.52,44.3 | 104.52,44.3 104.58,44.26 | 104.9,44.08 | 104.52,44.3 104.58,44.33 | 104.52,44.3 104.58,44.26 | 104.52,44.3 104.9,44.52 | 104.9,44.52 | v105.03,44.3 104.9,44.52 | 105.54,36.99 | 104.52,36.99 | 105.48,37.03 105.54,36.99 | 105.16,37.21 | v105.03,36.99 105.16,37.21 | 105.48,36.96 105.54,36.99 | 105.54,36.99 105.48,37.03 | 105.16,36.78 | 105.54,36.99 105.48,36.96 | 104.52,36.99 104.58,36.96 | 104.9,36.78 | 104.58,37.03 104.52,36.99 | 104.52,36.99 104.58,36.96 | 104.9,37.21 104.52,36.99 | 104.9,37.21 | v105.03,36.99 104.9,37.21 | 104.58,44.3 104.89,44.09 v105.03,44.3 | 104.58,44.3 104.89,44.51 v105.03,44.3 | 104.9,44.08 104.58,44.26 | 104.9,44.08 | 104.58,44.26 104.87,44.49 | 104.58,44.33 104.87,44.1 | 104.87,44.1 | v105.03,44.3 104.87,44.1 | 104.9,44.52 104.58,44.33 | 104.9,44.08 104.58,44.26 | 104.9,44.08 | v105.03,44.3 104.9,44.08 | 104.58,44.26 104.87,44.49 | v105.03,44.3 104.87,44.49 | 104.58,44.33 104.87,44.1 | v105.03,44.3 104.87,44.1 | 104.9,44.52 104.58,44.33 | 105.48,36.99 105.17,37.2 v105.03,36.99 | 105.48,36.99 105.17,36.79 v105.03,36.99 | 104.58,36.99 104.89,36.79 v105.03,36.99 | 104.58,36.99 104.89,37.2 v105.03,36.99 | 105.16,37.21 | 105.19,36.8 105.48,37.03 | v105.03,36.99 105.19,36.8
  Bottom 0.2: 105.16,37.21 105.48,37.03 | 105.19,36.8 105.48,37.03 | v105.03,36.99 105.19,36.8 | 105.19,37.19 105.48,36.96 | 105.16,36.78 | 105.16,36.78 105.48,36.96 | v105.03,36.99 105.16,36.78 | 105.16,37.21 105.48,37.03 105.19,36.8 | v105.03,36.99 105.19,36.8 | 105.19,37.19 105.48,36.96 | v105.03,36.99 105.19,37.19 | 105.16,36.78 105.48,36.96 | 104.9,36.78 104.58,36.96 | 104.9,36.78 | 104.87,37.19 104.58,36.96 | 104.87,36.8 104.58,37.03 104.9,37.21 | 104.87,36.8 | v105.03,36.99 104.87,36.8 | 104.9,36.78 | 104.9,36.78 104.58,36.96 | v105.03,36.99 104.9,36.78 | 104.87,37.19 104.58,36.96 | v105.03,36.99 104.87,37.19 | 104.87,36.8 104.58,37.03 | v105.03,36.99 104.87,36.8 | 104.9,37.21 104.58,37.03 | 104.52,44.3 | 104.52,44.3 104.9,44.08 | 104.9,44.08 | 104.9,44.08 | v105.03,44.3 104.9,44.08 | 104.52,44.3 104.9,44.52 | 104.9,44.52 | 104.9,44.52 v105.03,44.3 | 104.52,44.3 104.9,44.08 | 104.9,44.08 v105.03,44.3 | 104.52,44.3 104.9,44.52 | 104.9,44.52 | 104.9,44.52 v105.03,44.3 | 104.52,44.3 104.9,44.08 | v105.03,44.3 104.9,44.08 | 104.9,44.52 104.52,44.3 | 104.9,44.52 v105.03,44.3 | 105.16,37.21 105.54,36.99 | 104.52,36.99 | 105.16,37.21 105.54,36.99 | v105.03,36.99 105.16,37.21 | 105.54,36.99 | 105.16,36.78 | v105.03,36.99 105.16,36.78 | 105.16,37.21 105.54,36.99 | 105.16,37.21 | 105.54,36.99 | 105.16,36.78 105.54,36.99 | v105.03,36.99 105.16,36.78 | 105.16,37.21 105.54,36.99 | v105.03,36.99 105.16,37.21 | 105.16,36.78 105.54,36.99 | v105.03,36.99 105.16,36.78 | 104.9,36.78 104.52,36.99 | 104.9,36.78 | 104.9,36.78 | v105.03,36.99 104.9,36.78 | 104.9,37.21 104.52,36.99 | 104.9,37.21 | v105.03,36.99 104.9,37.21 | 104.9,36.78 104.52,36.99 | v105.03,36.99 104.9,36.78 | 104.9,37.21 104.52,36.99 | 104.9,37.21
  Bottom 0.2: v105.03,36.99 104.9,37.21 | 104.9,36.78 104.52,36.99 | v105.03,36.99 104.9,36.78 | 104.9,37.21 104.52,36.99 | v105.03,36.99 104.9,37.21
/INT
  Bottom 0.2: J1.C21 10.41,62.46 10.16,62.71 2.79,62.71 2.16,62.08 2.16,8.42 2.48,8.1 4.45,8.1 4.7,7.85 4.7,7.72 4.95,7.47 23.02,7.47 25.02,5.47 25.02,2.39 26.29,1.12 131.02,1.12 132.02,2.12 132.02,7.47 | 132.02,7.47 132.02,25.06 130.75,26.34 IC100.P39 | R100.1 132.02,7.47
/IPL0
  Bottom 0.2: IC3.J12 73.91,38.9 74.55,38.27 74.55,36.04 75.18,35.41 85.03,35.41 88.2,32.23 100.9,32.23 101.85,31.28 103.13,31.28 104.08,30.34 IC100.P95
/IPL1
  Bottom 0.2: IC3.J13 52.32,37.95 52.64,37.63 73.28,37.63 73.91,36.99 73.91,33.5 74.55,32.87 85.3,32.87 86.3,31.87 87.25,30.96 99.63,30.96 100.58,30.01 102.13,30.01 102.81,29.34 IC100.P93
/IPL2
  Bottom 0.2: IC3.H12 72.64,36.36 73.28,35.73 73.28,32.87 73.91,32.23 84.66,32.23 85.66,31.23 86.61,30.33 99,30.33 99.95,29.38 101.63,29.38 102.17,28.84 IC100.P92
/NMI  (via drill 0.3)
  Top 0.2: J1.C20 9.14,57.63 2.16,57.63 1.52,57 1.52,8.74 2.16,8.1 6.6,8.1 7.24,7.47 7.24,1.48 8.24,0.48 136.78,0.48 137.1,0.8 137.1,1.24 | 137.1,1.24 137.1,1.3 | v137.1,1.75 137.1,1.3 | 137.1,1.24 137.32,1.63 | 137.1,1.24 | 137.1,1.24 137.13,1.3 | 137.32,1.63 | v137.1,1.75 137.32,1.63 | 137.1,1.24 137.06,1.3 | 137.1,1.24 137.13,1.3 | 137.1,1.24 137.06,1.3 | 136.88,1.63 | 137.1,1.3 137.31,1.61 v137.1,1.75 | 137.1,1.3 136.89,1.61 v137.1,1.75 | 137.32,1.63 137.13,1.3 | 137.32,1.63 | 137.13,1.3 136.9,1.59 v137.1,1.75 | 137.06,1.3 137.29,1.59 | 137.06,1.3 136.88,1.63 | 136.88,1.63 | v137.1,1.75 136.88,1.63 | 137.32,1.63 137.13,1.3 | 137.13,1.3 136.9,1.59 v137.1,1.75 | 137.29,1.59 137.06,1.3 | v137.1,1.75 137.29,1.59 | 136.88,1.63 137.06,1.3 | 137.1,1.24 137.32,1.63 | 137.32,1.63 137.1,1.24 | 137.32,1.63 v137.1,1.75 | 137.1,1.24 | 136.88,1.63 | v137.1,1.75 136.88,1.63 | 137.1,1.24 137.32,1.63 | 137.32,1.63 | 137.1,1.24 | 137.1,1.24 136.88,1.63 | 136.88,1.63 v137.1,1.75 | 137.1,1.24 137.32,1.63 | 137.32,1.63 v137.1,1.75 | 137.1,1.24 136.88,1.63 | 136.88,1.63 v137.1,1.75
  Bottom 0.2: v137.1,1.75 137.1,2.2 | 137.1,2.2 137.1,2.26 | 137.1,2.26 137.1,7.47 | 137.1,7.47 137.1,28.06 135.83,29.34 IC100.P33 | R101.1 137.1,7.47 | 137.1,2.26 | 137.1,2.26 137.06,2.2 | 136.88,1.88 | 137.13,2.2 137.1,2.26 | 137.06,2.2 137.1,2.26 | 137.13,2.2 137.1,2.26 | 137.32,1.88 | v137.1,1.75 137.32,1.88 | 137.1,2.2 136.89,1.9 v137.1,1.75 | 137.1,2.2 137.31,1.9 v137.1,1.75 | 136.88,1.88 137.06,2.2 | 136.88,1.88 | 137.29,1.91 137.06,2.2 | 136.9,1.91 137.13,2.2 | 136.9,1.91 | v137.1,1.75 136.9,1.91 | 137.32,1.88 137.13,2.2 | 136.88,1.88 | 136.88,1.88 137.06,2.2 | v137.1,1.75 136.88,1.88 | 137.29,1.91 137.06,2.2 | v137.1,1.75 137.29,1.91 | 136.9,1.91 137.13,2.2 | v137.1,1.75 136.9,1.91 | 137.32,1.88 137.13,2.2 | 137.1,2.26 | 136.88,1.88 137.1,2.26 | 136.88,1.88 | 136.88,1.88 | v137.1,1.75 136.88,1.88 | 137.32,1.88 137.1,2.26 | 137.32,1.88 | v137.1,1.75 137.32,1.88 | 136.88,1.88 137.1,2.26 | v137.1,1.75 136.88,1.88 | 137.32,1.88 137.1,2.26 | 137.32,1.88 | v137.1,1.75 137.32,1.88 | 136.88,1.88 137.1,2.26 | v137.1,1.75 136.88,1.88 | 137.32,1.88 137.1,2.26 | v137.1,1.75 137.32,1.88
/RES
  Bottom 0.2: IC100.P32 136.32,29.84 138.05,28.11 138.05,23.02 139,22.07 | 139,22.07 139,21.75 | 139,21.75 IC1.5 | 139,22.07 139.32,22.07 | 139.32,22.07 R104.2 | 139,21.75 139.32,22.07
/RESET  (via drill 0.3)
  Top 0.2: IC106.13 63.44,84.62 63.44,92.36 | v63.44,92.88 63.44,92.42 | 63.44,92.42 63.44,92.36 | IC3.C01 85.22,23.66 85.86,23.02 94.55,23.02 95.51,22.07 R10.2 98.36,22.07 99,22.71 99,24.29 99.31,24.61 103.44,24.61 105.98,22.07 111.3,22.07 | 111.38,22.07 v111.7,22.39 | 111.3,22.07 111.38,22.07 | 63.44,92.36 | 63.44,92.36 63.47,92.43 | 63.66,92.75 | 63.4,92.43 63.44,92.36 | 63.44,92.36 63.47,92.43 | 63.22,92.75 63.44,92.36 | 63.22,92.75 | v63.44,92.88 63.22,92.75 | 111.3,22.07 111.37,22.08 | 63.44,92.42 63.65,92.73 v63.44,92.88 | 63.44,92.42 63.23,92.73 v63.44,92.88 | 63.66,92.75 63.47,92.43 | 63.66,92.75 | 63.24,92.72 63.47,92.43 | 63.63,92.72 63.4,92.43 | 63.63,92.72 | v63.44,92.88 63.63,92.72 | 63.22,92.75 63.4,92.43 | 63.66,92.75 | 63.66,92.75 63.47,92.43 | v63.44,92.88 63.66,92.75 | 63.24,92.72 63.47,92.43 | v63.44,92.88 63.24,92.72 | 63.63,92.72 63.4,92.43 | v63.44,92.88 63.63,92.72 | 63.22,92.75 63.4,92.43 | 111.38,22.07 111.74,22.14 v111.7,22.39 | 111.38,22.07 111.45,22.44 v111.7,22.39 | 111.74,22.14 111.37,22.08 | 111.37,22.08 111.45,22.45 v111.7,22.39 | v111.7,22.39 111.7,22.14 111.32,22.14 111.46,22.48 | 63.44,92.36 | 63.66,92.75 63.44,92.36 | 63.66,92.75 | 63.66,92.75 | v63.44,92.88 63.66,92.75 | 63.22,92.75 63.44,92.36 | 63.22,92.75 | v63.44,92.88 63.22,92.75 | 63.66,92.75 63.44,92.36 | v63.44,92.88 63.66,92.75 | 63.22,92.75 63.44,92.36 | 63.22,92.75 | v63.44,92.88 63.22,92.75 | 63.66,92.75 63.44,92.36 | v63.44,92.88 63.66,92.75 | 63.22,92.75 63.44,92.36 | v63.44,92.88 63.22,92.75 | 111.74,22.14 111.3,22.07 | v111.7,22.39 111.74,22.14 | 111.46,22.48 111.3,22.07 | v111.7,22.39 111.46,22.48
  Bottom 0.2: J1.C31 13.27,86.84 13.91,87.48 13.91,91.61 15.18,92.88 62.93,92.88 | 62.93,92.88 62.99,92.88 | v63.44,92.88 62.99,92.88 | v63.44,92.88 63.89,92.88 | 63.89,92.88 63.95,92.88 | 111.7,22.9 111.7,28.42 114.01,30.73 IC100.P10 114.01,40.39 112.01,42.39 95.92,42.39 93.92,44.39 93.92,92.24 93.28,92.88 63.95,92.88 | 111.7,22.9 111.7,22.84 | 111.7,22.84 v111.7,22.39 | 62.93,92.88 | 63.56,93.09 63.95,92.88 | 63.95,92.88 | 62.93,92.87 62.99,92.84 | 63.31,92.66 | 62.93,92.87 62.99,92.91 | 62.93,92.88 62.99,92.84 | 62.93,92.88 62.99,92.91 | 63.31,93.09 | v63.44,92.88 63.31,93.09 | 63.95,92.88 63.89,92.91 | 63.56,93.09 | v63.44,92.88 63.56,93.09 | 63.89,92.84 63.95,92.88 | 63.95,92.87 63.89,92.91 | 63.56,92.66 | 63.95,92.87 63.89,92.84 | 111.7,22.9 111.73,22.84 | 62.99,92.88 63.29,92.67 v63.44,92.88 | 62.99,92.88 63.29,93.08 v63.44,92.88 | 63.89,92.88 63.58,93.08 v63.44,92.88 | 63.89,92.88 63.58,92.67 v63.44,92.88 | 63.31,92.66 62.99,92.84 | 63.31,92.66 | 62.99,92.84 63.28,93.07 | 62.99,92.91 63.28,92.68 | 63.28,92.68 | v63.44,92.88 63.28,92.68 | 63.31,93.09 62.99,92.91 | 63.31,92.66 62.99,92.84 | 63.31,92.66 | v63.44,92.88 63.31,92.66 | 62.99,92.84 63.28,93.07 | v63.44,92.88 63.28,93.07 | 62.99,92.91 63.28,92.68 | v63.44,92.88 63.28,92.68 | 63.31,93.09 62.99,92.91 | 63.56,93.09 63.89,92.91 | 63.56,93.09 | 63.6,92.68 63.89,92.91 | v63.44,92.88 63.6,92.68 | 63.6,93.07 63.89,92.84 | 63.56,92.66 | 63.56,92.66 63.89,92.84 | v63.44,92.88 63.56,92.66 | 63.56,93.09 63.89,92.91 | 63.6,92.68 63.89,92.91 | v63.44,92.88 63.6,92.68 | 63.6,93.07 63.89,92.84 | v63.44,92.88 63.6,93.07 | 63.56,92.66 63.89,92.84 | 111.7,22.84 111.49,22.53 v111.7,22.39 | 111.7,22.84 111.91,22.53 v111.7,22.39
  Bottom 0.2: 111.48,22.52 | 111.48,22.52 111.66,22.84 111.89,22.55 v111.7,22.39 | 111.48,22.52 | 111.73,22.84 111.5,22.55 v111.7,22.39 | 111.73,22.84 111.92,22.52 | 111.92,22.52 | 62.93,92.88 62.93,92.87 | 63.56,93.09 63.95,92.88 | 62.93,92.87 63.31,92.66 | 63.31,92.66 | 63.31,92.66 | v63.44,92.88 63.31,92.66 | 62.93,92.87 63.31,93.09 | 63.31,93.09 | 63.31,93.09 v63.44,92.88 | 62.93,92.88 63.31,92.66 | 63.31,92.66 v63.44,92.88 | 62.93,92.88 63.31,93.09 | 63.31,93.09 | 63.31,93.09 v63.44,92.88 | 62.93,92.87 63.31,92.66 | v63.44,92.88 63.31,92.66 | 63.31,93.09 62.93,92.87 | 63.31,93.09 v63.44,92.88 | 63.56,93.09 63.95,92.87 | v63.44,92.88 63.56,93.09 | 63.95,92.87 | 63.56,92.66 | v63.44,92.88 63.56,92.66 | 63.56,93.09 63.95,92.88 | 63.56,93.09 | 63.95,92.87 63.95,92.88 | 63.56,92.66 63.95,92.87 | v63.44,92.88 63.56,92.66 | 63.56,93.09 63.95,92.87 | v63.44,92.88 63.56,93.09 | 63.56,92.66 63.95,92.87 | v63.44,92.88 63.56,92.66 | 111.7,22.9 | 111.7,22.9 111.48,22.52 | 111.48,22.52 v111.7,22.39 | 111.7,22.9 | 111.7,22.9 111.92,22.52 | 111.92,22.52 v111.7,22.39 | 111.7,22.9 111.48,22.52 | 111.48,22.52 | v111.7,22.39 111.48,22.52 | 111.7,22.9 111.92,22.52 | 111.92,22.52 v111.7,22.39 | 111.7,22.9 111.48,22.52 | 111.48,22.52 v111.7,22.39 | 111.7,22.9 111.92,22.52 | 111.92,22.52 v111.7,22.39
/RMC
  Bottom 0.2: IC3.E02 80.26,27.47 80.58,27.15 85.93,27.15 86.93,26.15 86.93,24.98 87.93,23.98 99.59,23.98 99.95,24.34 100.95,25.34 IC100.P85
/RTC_CS
  Bottom 0.2: IC100.P28 148.43,31.84 152.97,36.38 152.97,88.39 150.68,90.68 | 150.68,90.68 150.43,90.97 | IC8.13 150.41,90.95 150.68,90.68
/WAIT  (via drill 0.3)
  Top 0.2: R2.1 116.97,25.88 | v116.46,25.88 116.91,25.88 | 116.91,25.88 116.97,25.88 | 116.97,25.88 | 116.91,25.92 116.97,25.88 | 116.59,26.1 | v116.46,25.88 116.59,26.1 | 116.91,25.85 116.97,25.88 | 116.97,25.88 116.91,25.92 | 116.59,25.66 | 116.97,25.88 116.91,25.85 | 116.91,25.88 116.6,26.09 v116.46,25.88 | 116.91,25.88 116.6,25.67 v116.46,25.88 | 116.59,26.1 | 116.62,25.68 116.91,25.92 | v116.46,25.88 116.62,25.68 | 116.59,26.1 116.91,25.92 | 116.62,25.68 116.91,25.92 | v116.46,25.88 116.62,25.68 | 116.62,26.08 116.91,25.85 | 116.59,25.66 | 116.59,25.66 116.91,25.85 | v116.46,25.88 116.59,25.66 | 116.59,26.1 116.91,25.92 | 116.62,25.68 116.91,25.92 | v116.46,25.88 116.62,25.68 | 116.62,26.08 116.91,25.85 | v116.46,25.88 116.62,26.08 | 116.59,25.66 116.91,25.85 | 116.59,26.1 116.97,25.88 | 116.59,26.1 116.97,25.88 | v116.46,25.88 116.59,26.1 | 116.97,25.88 | 116.59,25.66 | v116.46,25.88 116.59,25.66 | 116.59,26.1 116.97,25.88 | 116.59,26.1 | 116.97,25.88 | 116.59,25.66 116.97,25.88 | v116.46,25.88 116.59,25.66 | 116.59,26.1 116.97,25.88 | v116.46,25.88 116.59,26.1 | 116.59,25.66 116.97,25.88 | v116.46,25.88 116.59,25.66
  Bottom 0.2: J1.A10 4.38,33.5 4.06,33.19 4.06,12.17 4.32,11.91 6.35,11.91 6.6,11.66 6.6,9.63 6.86,9.37 24.92,9.37 26.92,7.37 26.92,4.29 28.19,3.02 129.11,3.02 130.11,4.02 130.11,23.56 128.84,24.84 IC100.P42 122.27,24.84 121.54,25.56 116.86,25.56 | 116.86,25.56 116.78,25.56 | 116.78,25.56 v116.46,25.88 | 116.86,25.56 116.79,25.58 | 116.78,25.56 116.71,25.93 v116.46,25.88 | 116.78,25.56 116.41,25.63 v116.46,25.88 | 116.69,25.98 116.83,25.63 116.46,25.63 v116.46,25.88 | 116.79,25.58 116.71,25.94 v116.46,25.88 | 116.79,25.58 116.42,25.63 | 116.86,25.56 116.69,25.98 | 116.69,25.98 v116.46,25.88 | 116.86,25.56 116.42,25.63 | 116.42,25.63 v116.46,25.88
A0  (via drill 0.3)